# Altium schematic sheet DopaDriver_2024-03-28.schdoc
size 472 x 371 mm
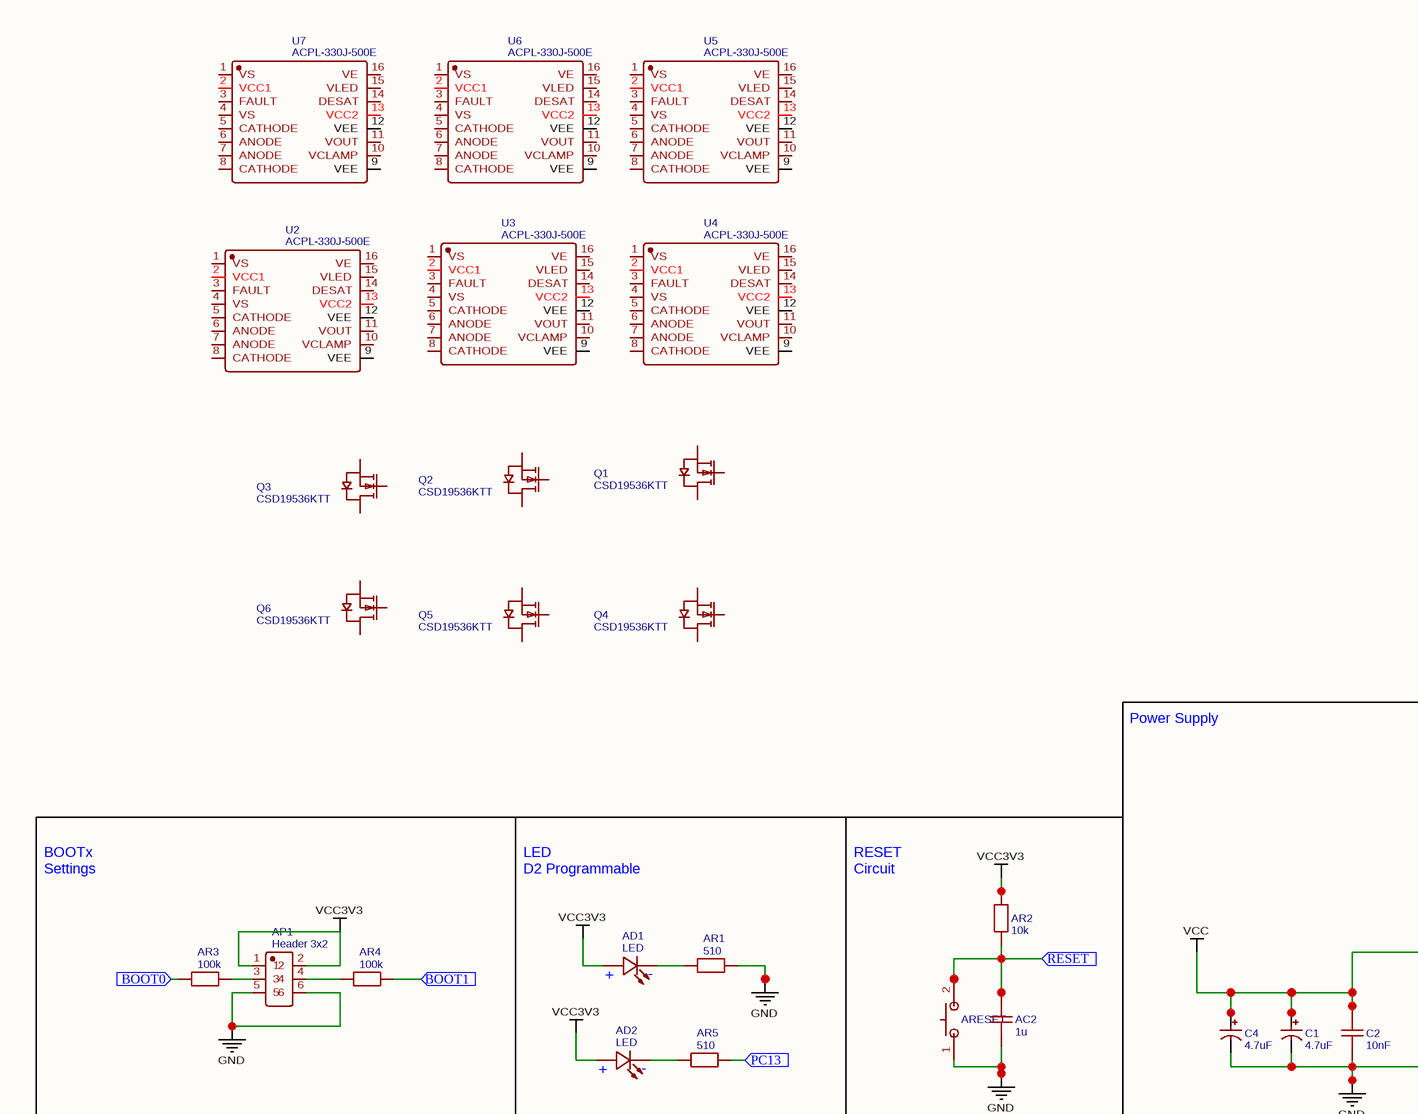
[diagram p0: DopaDriver_2024-03-28.schdoc, top left]
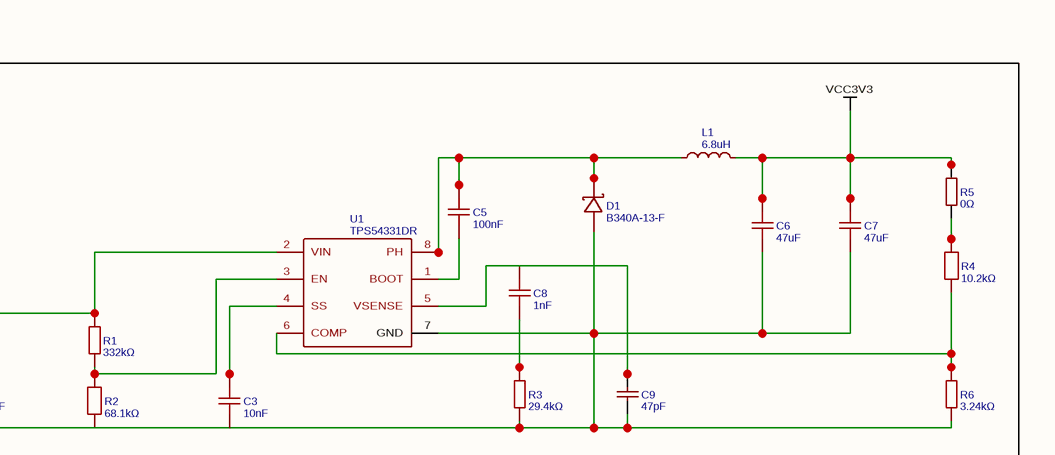
[diagram p1: DopaDriver_2024-03-28.schdoc, top right]
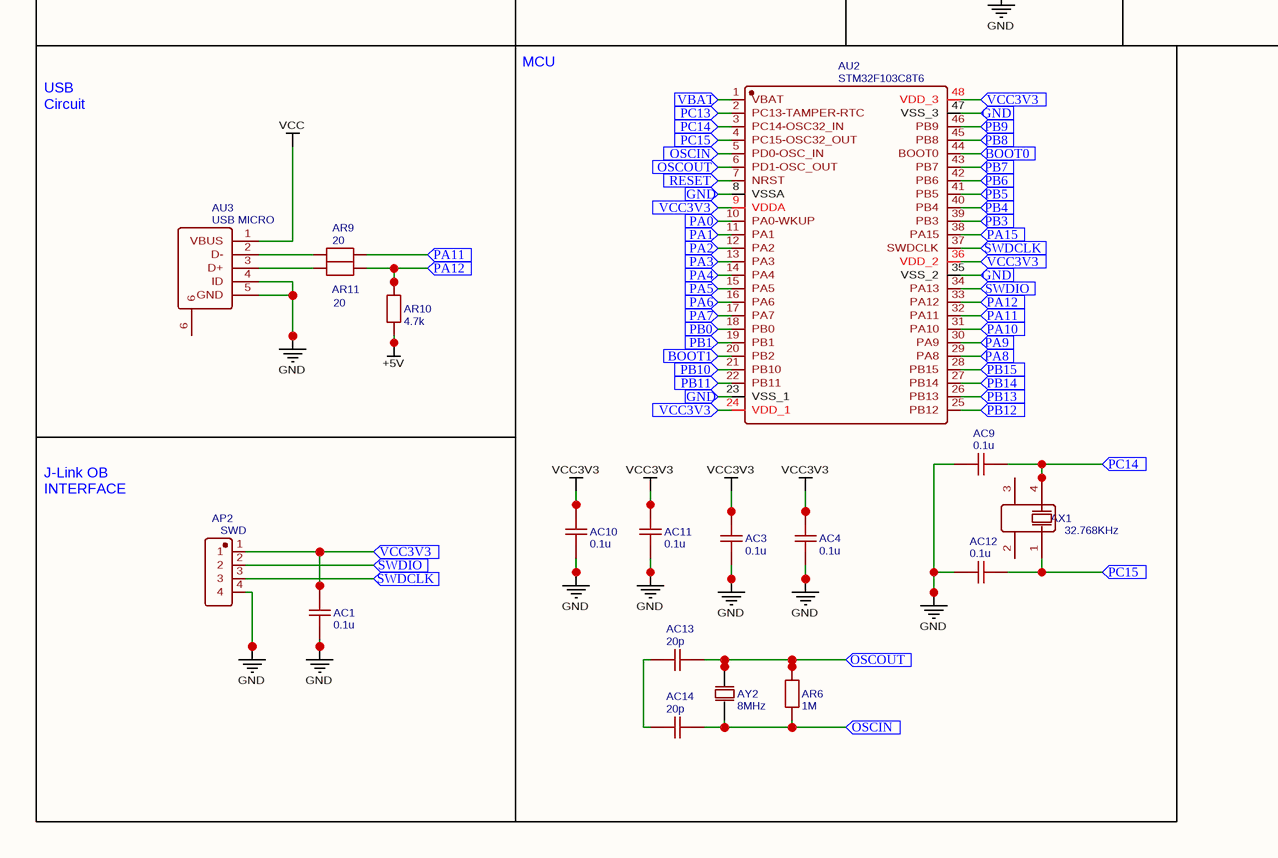
[diagram p2: DopaDriver_2024-03-28.schdoc, bottom left]

## Parts
AC1  0.1u  [C0603]
AC2  1u  [C0603]
AC3  0.1u  [C0603]
AC4  0.1u  [C0603]
AC9  0.1u  [C0603]
AC10  0.1u  [C0603]
AC11  0.1u  [C0603]
AC12  0.1u  [C0603]
AC13  20p  [C0603]
AC14  20p  [C0603]
AD1  LED  [LED-SMD_L2.0-W0.5-RD]
AD2  LED  [LED-SMD_L2.0-W0.5-RD]
AP1  Header 3x2  [HDR-TH_6P-P2.54-V-M-R2-C3-S2.54]
AP2  SWD  [HDR-TH_4P-P2.54-H-M-W10.4]
AR1  510  [R0603]
AR2  10k  [R0603]
AR3  100k  [R0603]
AR4  100k  [R0603]
AR5  510  [R0603]
AR6  1M  [R0603]
AR9  20  [R0603]
AR10  4.7k  [R0603]
AR11  20  [R0603]
ARESET  GT-TC057B-H043-L1  [SW-SMD_L6.0-W3.5-LS8.0]  (value not drawn)
AU2  STM32F103C8T6  [LQFP-48_L7.0-W7.0-P0.50-LS9.0-BL]
AU3  USB MICRO  [MICRO-USB-SMD_5P-P0.65-H-F_MICRO5.9MMUSB]
AX1  32.768KHz  [OSC-SMD_4P-L8.0-W3.2-BL]
AY2  8MHz  [OSC-TH_L10.0-W4.5-P5.00]
C1  4.7uF  [CAP-SMD_BD4.0-L4.3-W4.3-LS5.3-FD]
C2  10nF  [C0805]
C3  10nF  [C0805]
C4  4.7uF  [CAP-SMD_BD4.0-L4.3-W4.3-LS5.3-FD]
C5  100nF  [C0603]
C6  47uF  [C2220]
C7  47uF  [C2220]
C8  1nF  [C0603]
C9  47pF  [C0603]
D1  B340A-13-F  [SMA_L4.4-W2.6-LS5.0-RD]
L1  6.8uH  [IND-SMD_L7.0-W6.6_FXL0650]
Q1  CSD19536KTT  [TO-263-3_L10.1-W9.0-P5.08-LS15.2-BL-1]
Q2  CSD19536KTT  [TO-263-3_L10.1-W9.0-P5.08-LS15.2-BL-1]
Q3  CSD19536KTT  [TO-263-3_L10.1-W9.0-P5.08-LS15.2-BL-1]
Q4  CSD19536KTT  [TO-263-3_L10.1-W9.0-P5.08-LS15.2-BL-1]
Q5  CSD19536KTT  [TO-263-3_L10.1-W9.0-P5.08-LS15.2-BL-1]
Q6  CSD19536KTT  [TO-263-3_L10.1-W9.0-P5.08-LS15.2-BL-1]
R1  332kΩ  [R0603]
R2  68.1kΩ  [R0603]
R3  29.4kΩ  [R0603]
R4  10.2kΩ  [R0603]
R5  0Ω  [R0603]
R6  3.24kΩ  [R0603]
U1  TPS54331DR  [SOIC-8_L5.0-W4.0-P1.27-LS6.0-BL]
U2  ACPL-330J-500E  [WSOIC-16_L10.3-W7.5-P1.27-LS10.3-BL]
U3  ACPL-330J-500E  [WSOIC-16_L10.3-W7.5-P1.27-LS10.3-BL]
U4  ACPL-330J-500E  [WSOIC-16_L10.3-W7.5-P1.27-LS10.3-BL]
U5  ACPL-330J-500E  [WSOIC-16_L10.3-W7.5-P1.27-LS10.3-BL]
U6  ACPL-330J-500E  [WSOIC-16_L10.3-W7.5-P1.27-LS10.3-BL]
U7  ACPL-330J-500E  [WSOIC-16_L10.3-W7.5-P1.27-LS10.3-BL]

## Blocks framed on the sheet
Power Supply: C1-C9 D1 L1 R1-R6 U1
MCU: AC3 AC4 AC9-AC14 AR6 AU2 AX1 AY2

## Ports
BOOT0 (in), BOOT1 (in), GND (in), OSCIN (in), OSCOUT (in), PA0 (in), PA1 (in), PA2 (in), PA3 (in), PA4 (in), PA5 (in), PA6 (in), PA7 (in), PA8 (in), PA9 (in), PA10 (in), PA11 (in), PA12 (in), PA15 (in), PB0 (in), PB1 (in), PB3 (in), PB4 (in), PB5 (in), PB6 (in), PB7 (in), PB8 (in), PB9 (in), PB10 (in), PB11 (in), PB12 (in), PB13 (in), PB14 (in), PB15 (in), PC13 (in), PC14 (in), PC15 (in), RESET (in), SWDCLK (in), SWDIO (in), VBAT (in), VCC3V3 (in)

## Nets
+5V: AR10.1
GND: AC1.1 AC2.1 AC3.1 AC4.1 AC9.1 AC10.1 AC11.1 AC12.2 AP1.5 AP1.6 AP2.4 AR1.2 ARESET.1 AU3.4(ID) AU3.5(GND) C1.2 C2.1 C3.1 C4.2 C6.1 C7.1 C9.1 D1.2(A) R2.1 R3.1 R6.1 U1.7(GND)
VCC: AU3.1(VBUS) C1.1 C2.2 C4.1 R1.2 U1.2(VIN)
VCC3V3: AC3.2 AC4.2 AC10.2 AC11.2 AD1.2 AD2.2 AP1.1 AP1.2 AR2.2 C6.2 C7.2 L1.2 R5.2
BOOT0: AR3.1 AU2.44(BOOT0) ; port BOOT0
BOOT1: AR4.2 AU2.20(PB2) ; port BOOT1
GND: AU2.8(VSSA) AU2.23(VSS_1) AU2.35(VSS_2) AU2.47(VSS_3) ; port GND  [a separate net that carries the same name]
OSCIN: AC14.1 AR6.1 AU2.5(PD0-OSC_IN) AY2.2(OSC2) ; port OSCIN
OSCOUT: AC13.1 AR6.2 AU2.6(PD1-OSC_OUT) AY2.1(OSC1) ; port OSCOUT
PA0: AU2.10(PA0-WKUP) ; port PA0
PA1: AU2.11(PA1) ; port PA1
PA2: AU2.12(PA2) ; port PA2
PA3: AU2.13(PA3) ; port PA3
PA4: AU2.14(PA4) ; port PA4
PA5: AU2.15(PA5) ; port PA5
PA6: AU2.16(PA6) ; port PA6
PA7: AU2.17(PA7) ; port PA7
PA8: AU2.29(PA8) ; port PA8
PA9: AU2.30(PA9) ; port PA9
PA10: AU2.31(PA10) ; port PA10
PA11: AR9.2 AU2.32(PA11) ; port PA11
PA12: AR10.2 AR11.2 AU2.33(PA12) ; port PA12
PA15: AU2.38(PA15) ; port PA15
PB0: AU2.18(PB0) ; port PB0
PB1: AU2.19(PB1) ; port PB1
PB3: AU2.39(PB3) ; port PB3
PB4: AU2.40(PB4) ; port PB4
PB5: AU2.41(PB5) ; port PB5
PB6: AU2.42(PB6) ; port PB6
PB7: AU2.43(PB7) ; port PB7
PB8: AU2.45(PB8) ; port PB8
PB9: AU2.46(PB9) ; port PB9
PB10: AU2.21(PB10) ; port PB10
PB11: AU2.22(PB11) ; port PB11
PB12: AU2.25(PB12) ; port PB12
PB13: AU2.26(PB13) ; port PB13
PB14: AU2.27(PB14) ; port PB14
PB15: AU2.28(PB15) ; port PB15
PC13: AR5.2 AU2.2(PC13-TAMPER-RTC) ; port PC13
PC14: AC9.2 AU2.3(PC14-OSC32_IN) AX1.4 ; port PC14
PC15: AC12.1 AU2.4(PC15-OSC32_OUT) AX1.1 ; port PC15
RESET: AC2.2 AR2.1 ARESET.2 AU2.7(NRST) ; port RESET
SWDCLK: AP2.3 AU2.37(SWDCLK) ; port SWDCLK
SWDIO: AP2.2 AU2.34(PA13) ; port SWDIO
VBAT: AU2.1(VBAT) ; port VBAT
VCC3V3: AC1.2 AP2.1 AU2.9(VDDA) AU2.24(VDD_1) AU2.36(VDD_2) AU2.48(VDD_3) ; port VCC3V3  [a separate net that carries the same name]
NetAC13_2: AC13.2 AC14.2
NetAD1_1: AD1.1 AR1.1
NetAD2_1: AD2.1 AR5.1
NetAP1_3: AP1.3 AR3.2
NetAP1_4: AP1.4 AR4.1
NetAR9_1: AR9.1 AU3.2(D-)
NetAR11_1: AR11.1 AU3.3(D+)
NetC3_2: C3.2 U1.4(SS)
NetC5_1: C5.1 U1.1(BOOT)
NetC5_2: C5.2 D1.1(K) L1.1 U1.8(PH)
NetC8_1: C8.1 C9.2 U1.5(VSENSE)
NetC8_2: C8.2 R3.2
NetR1_1: R1.1 R2.2 U1.3(EN)
NetR4_1: R4.1 R6.2 U1.6(COMP)
NetR4_2: R4.2 R5.1

Not connected (* = marked no-connect by the designer): AU3 6; AX1 2 3; Q1 1(G) 2(D) 3(S); Q2 1(G) 2(D) 3(S); Q3 1(G) 2(D) 3(S); Q4 1(G) 2(D) 3(S); Q5 1(G) 2(D) 3(S); Q6 1(G) 2(D) 3(S); U2 1(VS) 2(VCC1) 3(FAULT) 4(VS) 5(CATHODE) 6(ANODE) 7(ANODE) 8(CATHODE) 9(VEE) 10(VCLAMP) 11(VOUT) 12(VEE) 13(VCC2) 14(DESAT) 15(VLED) 16(VE); U3 1(VS) 2(VCC1) 3(FAULT) 4(VS) 5(CATHODE) 6(ANODE) 7(ANODE) 8(CATHODE) 9(VEE) 10(VCLAMP) 11(VOUT) 12(VEE) 13(VCC2) 14(DESAT) 15(VLED) 16(VE); U4 1(VS) 2(VCC1) 3(FAULT) 4(VS) 5(CATHODE) 6(ANODE) 7(ANODE) 8(CATHODE) 9(VEE) 10(VCLAMP) 11(VOUT) 12(VEE) 13(VCC2) 14(DESAT) 15(VLED) 16(VE); U5 1(VS) 2(VCC1) 3(FAULT) 4(VS) 5(CATHODE) 6(ANODE) 7(ANODE) 8(CATHODE) 9(VEE) 10(VCLAMP) 11(VOUT) 12(VEE) 13(VCC2) 14(DESAT) 15(VLED) 16(VE); U6 1(VS) 2(VCC1) 3(FAULT) 4(VS) 5(CATHODE) 6(ANODE) 7(ANODE) 8(CATHODE) 9(VEE) 10(VCLAMP) 11(VOUT) 12(VEE) 13(VCC2) 14(DESAT) 15(VLED) 16(VE); U7 1(VS) 2(VCC1) 3(FAULT) 4(VS) 5(CATHODE) 6(ANODE) 7(ANODE) 8(CATHODE) 9(VEE) 10(VCLAMP) 11(VOUT) 12(VEE) 13(VCC2) 14(DESAT) 15(VLED) 16(VE)

## Notes on the sheet
- (near AR3) BOOTx
  Settings
- (near AD1) LED
  D2 Programmable
- (near AR2) RESET
  Circuit
- (near AU3) USB
  Circuit
- J-Link OB
  INTERFACE
- (in symbol LED) +; -

## Library data of the parts
AC1 AC3 AC4 AC9-AC12 = 0.1u: Manufacturer Part: TCC1206X7R104M500DT; Manufacturer: CCTC(三环); nameAlias: Value(F); Contributor: LCEDA_Lib; Supplier Part: C377067; Supplier: LCSC; spicePre: C; spiceSymbolName: C_0603_US
AC2 = 1u: Manufacturer Part: FS55X105K631EHG; Manufacturer: PSA(信昌电陶); nameAlias: Value(F); Contributor: LCEDA_Lib; Supplier Part: C784102; Supplier: LCSC; spicePre: C; spiceSymbolName: C_0603_US
AC13 AC14 = 20p: Manufacturer Part: CL10C200JB81PNC; Manufacturer: SAMSUNG(三星); nameAlias: Value(F); Contributor: LCEDA_Lib; Supplier Part: C346210; Supplier: LCSC; spicePre: C; spiceSymbolName: C_0603_US
AD1 AD2 = LED: Manufacturer: TOGIALED; Manufacturer Part: TJ-S2005SW9TGLC0A-A5; Contributor: LCSC; Supplier: LCSC; Supplier Part: C273620; spicePre: L; spiceSymbolName: TJ-S2005SW9TGLC0A-A5
AP1 = Header 3x2: Manufacturer: XFCN; Manufacturer Part: PZ254V-12-6P; Contributor: LCSC; Supplier: LCSC; Supplier Part: C492420; spicePre: H; spiceSymbolName: PZ254V-12-6P
AP2 = SWD: Manufacturer: XFCN; Manufacturer Part: PZ254R-11-04P; Contributor: LCSC; Supplier: LCSC; Supplier Part: C492412; spicePre: H; spiceSymbolName: PZ254R-11-04P
AR1 AR5 = 510: Manufacturer Part: RC0603FR-07510RL; Manufacturer: YAGEO(国巨); nameAlias: Value(Ω); Contributor: LCEDA_Lib; Supplier Part: C114670; Supplier: LCSC; spicePre: R; spiceSymbolName: R_0603_EU
AR2 = 10k: Manufacturer Part: ERA3VEB1002V; Manufacturer: PANASONIC(松下); nameAlias: Value(Ω); Contributor: LCEDA_Lib; Supplier Part: C490796; Supplier: LCSC; spicePre: R; spiceSymbolName: R_0603_EU
AR3 AR4 = 100k: Manufacturer Part: RS-03K104JT; Manufacturer: FH(风华); nameAlias: Value(Ω); Contributor: LCEDA_Lib; Supplier Part: C73806; Supplier: LCSC; spicePre: R; spiceSymbolName: R_0603_EU
AR6 = 1M: Manufacturer Part: RC0603JR-071ML; Manufacturer: YAGEO(国巨); nameAlias: Value(Ω); Contributor: LCEDA_Lib; Supplier Part: C107698; Supplier: LCSC; spicePre: R; spiceSymbolName: R_0603_EU
AR9 AR11 = 20: Manufacturer Part: CR0603-FX-20R0ELF; Manufacturer: BOURNS; nameAlias: Value(Ω); Contributor: LCEDA_Lib; Supplier Part: C203397; Supplier: LCSC; spicePre: R; spiceSymbolName: R_0603_EU
AR10 = 4.7k: Manufacturer Part: CR0603J4K70P05Z; Manufacturer: EVER OHMS(天二科技); nameAlias: Value(Ω); Contributor: LCEDA_Lib; Supplier Part: C881124; Supplier: LCSC; spicePre: R; spiceSymbolName: R_0603_EU
ARESET = GT-TC057B-H043-L1: Manufacturer: G-Switch; Contributor: LCSC; Supplier: LCSC; Supplier Part: C778167; Manufacturer Part: GT-TC057B-H043-L1; spicePre: S; spiceSymbolName: GT-TC057B-H043-L1
AU2 = STM32F103C8T6: Manufacturer: STMicroelectronics; SMT Type: Basic; timeStamp: 1455028086; Supplier: LCSC; Manufacturer Part: STM32F103C8T6; LCSC Assembly: Yes; image: //image.lceda.cn/szlcsc/C8734.jpg; Supplier Part: C8734; spicePre: U; spiceSymbolName: STM32F103C8T6
AU3 = USB MICRO: Manufacturer: SHOU HAN; Manufacturer Part: MICRO5.9mmusb; Contributor: LCSC; Supplier: LCSC; Supplier Part: C393940; spicePre: U; spiceSymbolName: MICRO5.9MMUSB
AX1 = 32.768KHz: Manufacturer: TKD; Manufacturer Part: M8-32.768KHZ-12.5PF-20PPM; nameAlias: Frequency; Contributor: LCSC; Supplier: LCSC; Supplier Part: C337679; spicePre: X; spiceSymbolName: M8-32.768KHZ-12.5PF-20PPM
AY2 = 8MHz: Manufacturer: YXC; Manufacturer Part: X49SD8MSD2SC; nameAlias: Frequency; Supplier: LCSC; Supplier Part: C21263; spicePre: X; spiceSymbolName: X49SD8MSD2SC
C1 C4 = 4.7uF: Manufacturer: CapXon(丰宾); Manufacturer Part: HV4R7M050B055ETR; nameAlias: Value; Supplier: LCSC; Supplier Part: C59949; JLCPCB Part Class: Extended Part; spicePre: C; spiceSymbolName: HV4R7M050B055R
C2 C3 = 10nF: Manufacturer: CCTC(三环); Manufacturer Part: TCC0805X7R103K500DT; nameAlias: Value; Contributor: LCSC; Supplier: LCSC; Supplier Part: C282728; JLCPCB Part Class: Extended Part; spicePre: C; spiceSymbolName: TCC0805X7R103K500DT
C5 = 100nF: Manufacturer: DARFON(达方); Manufacturer Part: C1608X7R104KGT; nameAlias: Value; Contributor: LCSC; Supplier: LCSC; Supplier Part: C701321; JLCPCB Part Class: Extended Part; spicePre: C; spiceSymbolName: C1608X7R104KGT
C6 C7 = 47uF: Manufacturer: TDK; Manufacturer Part: CGA9N3X7R1C476M230KB; nameAlias: Value; Contributor: LCSC; Supplier: LCSC; Supplier Part: C702871; JLCPCB Part Class: Extended Part; spicePre: C; spiceSymbolName: CGA9N3X7R1C476M230KB
C8 = 1nF: Manufacturer: YAGEO(国巨); Manufacturer Part: CC0603JRX7R7BB102; nameAlias: Value; Contributor: LCSC; Supplier: LCSC; Supplier Part: C519507; JLCPCB Part Class: Extended Part; spicePre: C; spiceSymbolName: CC0603JRX7R7BB102
C9 = 47pF: Manufacturer Part: CL10C470JB8NNNC; Manufacturer: SAMSUNG(三星); nameAlias: Value; Supplier: LCSC; Supplier Part: C1671; JLCPCB Part Class: Basic Part; spicePre: C; spiceSymbolName: CL10C470JB8NNNC
D1 = B340A-13-F: Manufacturer: DIODES(美台); Supplier: LCSC; Manufacturer Part: B340A-13-F; Supplier Part: C85098; JLCPCB Part Class: Extended Part; spicePre: D; spiceSymbolName: B340A-13-F
L1 = 6.8uH: Manufacturer: cjiang(长江微电); Manufacturer Part: FXL0650-6R8-M; nameAlias: Value; Contributor: LCSC; Supplier: LCSC; Supplier Part: C475530; JLCPCB Part Class: Extended Part; spicePre: L; spiceSymbolName: FXL0650-6R8-M
Q1-Q6 = CSD19536KTT: Manufacturer: TI(德州仪器); Contributor: LCSC; Supplier: LCSC; Supplier Part: C2687963; Manufacturer Part: CSD19536KTT; JLCPCB Part Class: Extended Part; spicePre: Q; spiceSymbolName: CSD19536KTT
R1 = 332kΩ: Manufacturer: FH(风华); Manufacturer Part: RS-03K3323FT; nameAlias: Value; Contributor: LCSC; Supplier: LCSC; Supplier Part: C321861; JLCPCB Part Class: Extended Part; spicePre: R; spiceSymbolName: RS-03K3323FT
R2 = 68.1kΩ: Manufacturer: EVER OHMS(天二科技); Manufacturer Part: TR0603D68K1P0510Z; nameAlias: Value; Contributor: LCSC; Supplier: LCSC; Supplier Part: C545758; JLCPCB Part Class: Extended Part; spicePre: R; spiceSymbolName: TR0603D68K1P0510Z
R3 = 29.4kΩ: Manufacturer: EVER OHMS(天二科技); Manufacturer Part: TR0603D29K4P0550; nameAlias: Value; Contributor: LCSC; Supplier: LCSC; Supplier Part: C149955; JLCPCB Part Class: Extended Part; spicePre: R; spiceSymbolName: TR0603D29K4P0550
R4 = 10.2kΩ: Manufacturer: YAGEO(国巨); Manufacturer Part: RT0603FRE0710K2L; Contributor: LCSC; nameAlias: Value; Supplier: LCSC; Supplier Part: C706118; JLCPCB Part Class: Extended Part; spicePre: R; spiceSymbolName: RT0603FRE0710K2L
R5 = 0Ω: Manufacturer: RALEC(旺诠); Manufacturer Part: RTT03000JTP; nameAlias: Value; Supplier: LCSC; Supplier Part: C103196; JLCPCB Part Class: Extended Part; spicePre: R; spiceSymbolName: RTT03000JTP
R6 = 3.24kΩ: Manufacturer: 大毅科技; Manufacturer Part: RMS06FT3241; nameAlias: Value; Contributor: LCSC; Supplier: LCSC; Supplier Part: C209112; JLCPCB Part Class: Extended Part; spicePre: R; spiceSymbolName: RMS06FT3241
U1 = TPS54331DR: Manufacturer: TI(德州仪器); Supplier: LCSC; Manufacturer Part: TPS54331DR; Supplier Part: C9865; spicePre: U; spiceSymbolName: TPS54331DR
U2-U7 = ACPL-330J-500E: Manufacturer: Broadcom/AVAGO(安华高); Contributor: LCSC; Supplier: LCSC; Supplier Part: C908115; Manufacturer Part: ACPL-330J-500E; JLCPCB Part Class: Extended Part; spicePre: U; spiceSymbolName: ACPL-330J-500E